# EAGLE design Simple-NPN-Regen-Receiver (EAGLE 7.2.0)
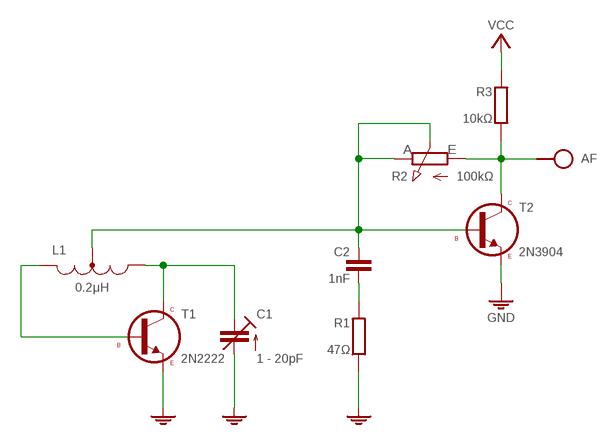
[diagram p0: schematic, sheet 1]

## Parts
AF  HPORT  [SPAD]
C1  1 - 20pF  C-TR-PH201272222-808-2PINB  [TRIM-2222-808]
C2  1nF  C025-024X044  [C025-024X044]
L1  0.2μH  L-H-TAPM-08/20V  [L-08/20V-TAPM]
R1  47Ω  R0204/10-V  [0204/10-V]
R2  100kΩ  POT-H  [POT]
R3  10kΩ  R0202/10-V  [0202/10-V]
S3  VCC_GNDR  [SPAD+-]
T1  2N2222  [TO92]
T2  2N3904  2N3904-A  [TO92-EBC-A]

## Nets
GND: C1.3(A) R1.2 S3.1 T1.3(E) T2.E
N$1: C2.2 R1.1
N$2: L1.1 T1.2(B)
N$3: C2.1 L1.T R2.E R2.S T2.B
N$4: C1.2(E) L1.2 T1.1(C)
N$5: AF.1 R2.A R3.2 T2.C
VCC: R3.1 S3.2

## Library data of the parts
AF = pad:HPORT
C1 = cap-trim:C-TR-PH20127
C2 = c:C: CAPACITOR, European symbol
L1 = l:L-H-TAPM
R1 R3 = r:R: RESISTOR, European symbol
R2 = r:POT-H
S3 = pad:VCC_GND
T1 = t:2N2222
T2 = t:2N3904

## Net classes
0 default: width 0.081 mm

## Board
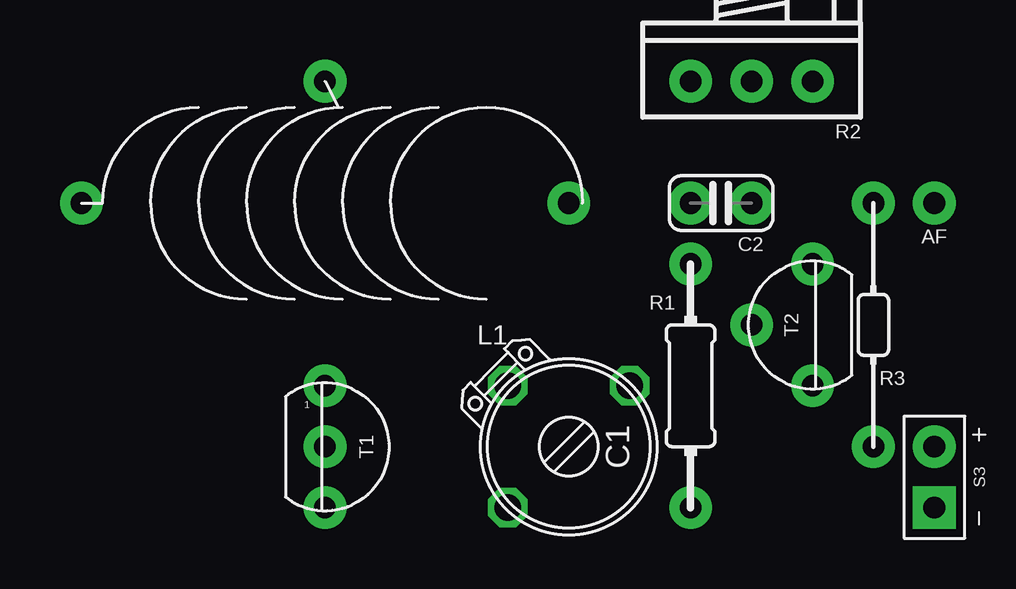
[diagram p1: board, top side]
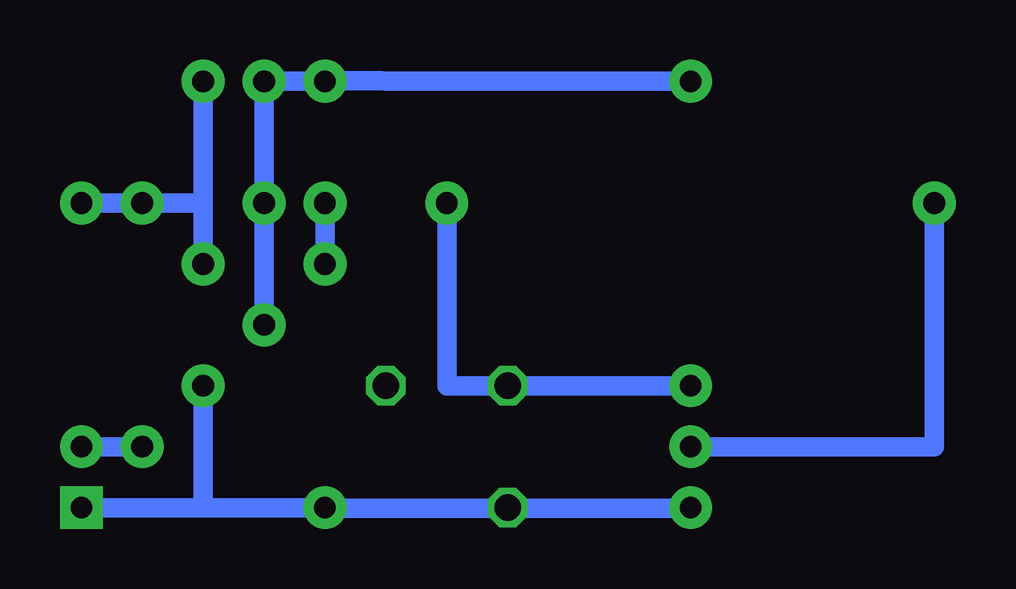
[diagram p2: board, bottom side, seen from below]

No outline drawn. Coordinates in mm, seen from the top.
Copper layers (1*16): Top 0.035mm / dielectric 1.5mm / Bottom 0.035mm
Design rules "default": minimum track width 10mil, minimum drill 24mil, track to track 8mil, track to pad 8mil, pad to pad 8mil, via to via 8mil, smd to smd 8mil, copper to edge 40mil, drill to drill 8mil, minimum pad ring 10mil, minimum via ring 8mil, stop-mask expansion 4mil, vias tented up to drill 0mil, thermal gap 10mil

### Footprints (pad centres in the part's own frame; a part is rotated, then mirrored left to right if it is on the bottom)
SPAD = drill 0.9 pad 1.778: 1 0,0
TRIM-2222-808 = drill 1.1 octagon: 1 -2.54,2.54; 2 -2.54,-2.54; 3 2.54,-2.54
C025-024X044 = drill 0.9 pad 1.778: 1 -1.27,0; 2 1.27,0
L-08/20V-TAPM = drill 0.9 pad 1.778: 1 0,10.16; 2 0,-10.16; T 5.08,0
0204/10-V = drill 0.9 pad 1.778: 1 0,5.08; 2 0,-5.08
POT = drill 0.9 pad 1.778: A -2.54,0; E 2.54,0; S 0,0
0202/10-V = drill 0.9 pad 1.778: 1 0,5.08; 2 0,-5.08
SPAD+- = drill 0.9 pad 1.778 square: 1 0,-1.27 | drill 0.9 pad 1.778: 2 0,1.27
TO92 = drill 0.9 pad 1.778: 1 0,2.54; 2 0,0; 3 0,-2.54
TO92-EBC-A = drill 0.9 pad 1.778: B -2.54,0; C 0,2.54; E 0,-2.54

### Placement (x,y rotation side)
AF  38.1,15.24 90 top
C1  22.86,5.08 270 top
C2  29.21,15.24 180 top
L1  12.7,15.24 90 top
R1  27.94,7.62 0 top
R2  30.48,20.32 180 top
R3  35.56,10.16 180 top
S3  38.1,3.81 0 top
T1  12.7,5.08 0 top
T2  33.02,10.16 0 top

### Tracks (layer width: path | path; a pad name or v marks a point on that pad's centre or on a via)
GND
  Bottom 0.254: 20.12,2.52 C1.3 20.34,2.52 | 12.8,2.52 T1.3 | 28.12,2.74 R1.2 27.89,2.52
  Bottom 0.813: 12.8,2.52 20.12,2.52 | 27.89,2.52 20.34,2.52 | S3.1 33.02,2.54 | 33.02,2.54 T2.E | 33.02,2.54 R1.2
N$1
  Bottom 0.813: C2.2 R1.1
N$2
  Bottom 0.813: T1.2 2.54,5.08 L1.1
N$3
  Bottom 0.254: 25.4,20.32 R2.E 25.6,20.34
  Bottom 0.813: T2.B C2.1 R2.S R2.E | 25.4,20.32 L1.T | 25.6,20.34 27.89,20.34
N$4
  Bottom 0.254: 12.8,7.77 T1.1
  Bottom 0.813: T1.1 C1.2 22.86,7.62 L1.2
N$5
  Bottom 0.813: R2.A 33.02,15.24 | 33.02,15.24 T2.C | 33.02,15.24 R3.2 AF.1
VCC
  Bottom 0.813: R3.1 S3.2